# EAGLE design gocupi_0.7.0 (EAGLE 6.4)
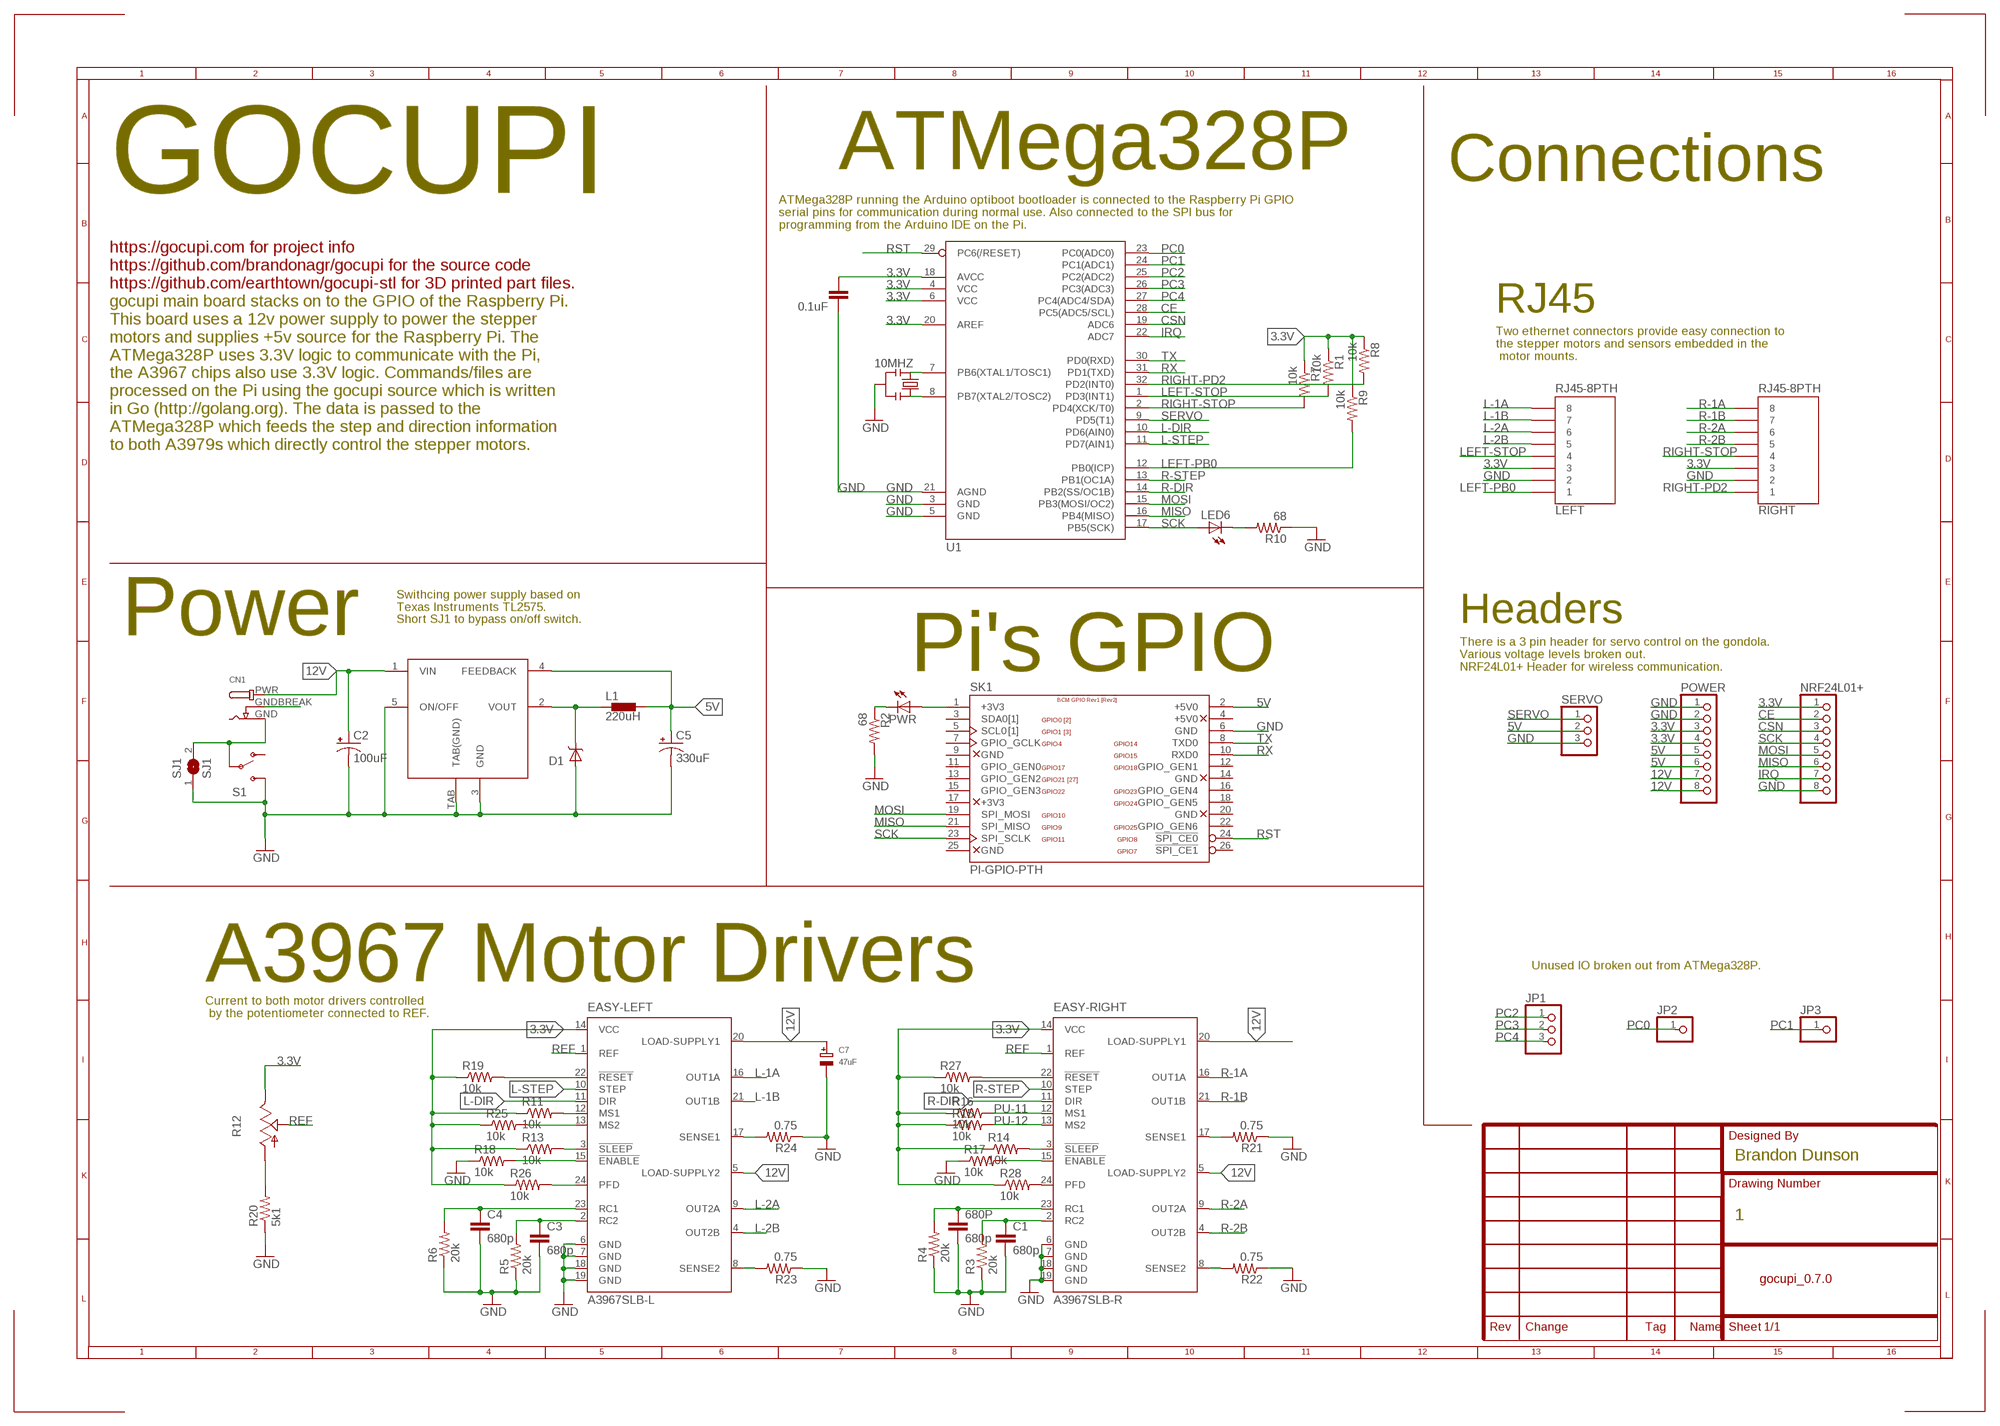
[diagram p0: schematic, sheet 1]

## Parts
10MHZ  RESONATORSMD  [RESONATOR-SMD]
680P  680p  CAP0805  [0805]
C1  680p  CAP0805  [0805]
C2  100uF  CPOL-USD  [PANASONIC_D]
C3  680p  CAP0805  [0805]
C4  680p  CAP0805  [0805]
C5  330uF  CPOL-USF  [PANASONIC_F]
C7  47uF  CAP_ELECTROLYTICPANASONIC_C  [PANASONIC_C]
C8  0.1uF  CAP0805  [0805]
CN1  DCBARRELSMT_CORRECT  [DCJACK_2MM_SMT]
D1  1N5819  DIODE-SCHOTTKY_  [SMA-DIODE]
EASY-LEFT  A3967SLB-L  A3967SLB  [SO24W]
EASY-RIGHT  A3967SLB-R  A3967SLB  [SO24W]
JP1  PINHD-1X3CB  [1X03-CLEANBIG]
JP2  PINHD-1X1CB  [1X01-CLEANBIG]
JP3  PINHD-1X1CB  [1X01-CLEANBIG]
L1  220uH  SDR1305  [SDR1305]
LED6  LEDCHIPLED_1206  [CHIPLED_1206]
LEFT  RJ45-8PTH  [RJ45-8]
NRF24L01+  PINHD-1X8BIG  [1X08-BIG]
POWER  PINHD-1X8CLEANBIG  [1X08-CLEANBIG]
PWR  LEDCHIPLED_1206  [CHIPLED_1206]
R1  10k  RESISTOR0805-RES  [0805]
R2  68  RESISTOR0805-RES  [0805]
R3  20k  RESISTOR0805-RES  [0805]
R4  20k  RESISTOR0805-RES  [0805]
R5  20k  RESISTOR0805-RES  [0805]
R6  20k  RESISTOR0805-RES  [0805]
R7  10k  RESISTOR0805-RES  [0805]
R8  10k  RESISTOR0805-RES  [0805]
R9  10k  RESISTOR0805-RES  [0805]
R10  68  RESISTOR0805-RES  [0805]
R11  10k  RESISTOR0805-RES  [0805]
R12  TRIM_US-SM-42/43A  [SM-42/43A]
R13  10k  RESISTOR0805-RES  [0805]
R14  10k  RESISTOR0805-RES  [0805]
R15  10k  RESISTOR0805-RES  [0805]
R16  10k  RESISTOR0805-RES  [0805]
R17  10k  RESISTOR0805-RES  [0805]
R18  10k  RESISTOR0805-RES  [0805]
R19  10k  RESISTOR0805-RES  [0805]
R20  5k1  RESISTOR0805-RES  [0805]
R21  0.75  RESISTOR0805-RES  [0805]
R22  0.75  RESISTOR0805-RES  [0805]
R23  0.75  RESISTOR0805-RES  [0805]
R24  0.75  RESISTOR0805-RES  [0805]
R25  10k  RESISTOR0805-RES  [0805]
R26  10k  RESISTOR0805-RES  [0805]
R27  10k  RESISTOR0805-RES  [0805]
R28  10k  RESISTOR0805-RES  [0805]
RIGHT  RJ45-8PTH  [RJ45-8]
S1  SWITCH-SPST-SMD-A  [SWITCH-SPST-SMD-A]
SERVO  PINHD-1X3  [1X03]
SJ1  SJ1  SJ  [SJ]
SK1  PI-GPIO-PTH  [GPIO-CONNECTOR]
U1  ATMEGA328_SMT  [TQFP32-08]
U$2  TL2575  [TO263_5]

## Nets
3.3V: C8.1 EASY-LEFT.14(VCC) EASY-RIGHT.14(VCC) LEFT.3 NRF24L01+.1 POWER.3 POWER.4 PWR.A R1.1 R7.1 R8.1 R9.1 R11.1 R12.3(E) R13.1 R14.1 R15.1 R16.1 R19.1 R25.1 R26.1 R27.1 R28.1 RIGHT.3 SK1.1(+3V3) U1.4(VCC) U1.6(VCC) U1.18(AVCC) U1.20(AREF)
5V: C5.+ L1.P$2 POWER.5 POWER.6 SERVO.2 SK1.2(+5V0) U$2.4(FEEDBACK)
12V: C2.+ C7.+ CN1.PWR EASY-LEFT.5(LOAD-SUPPLY2) EASY-LEFT.20(LOAD-SUPPLY1) EASY-RIGHT.5(LOAD-SUPPLY2) EASY-RIGHT.20(LOAD-SUPPLY1) POWER.7 POWER.8 U$2.1(VIN)
B-GND: CN1.GNDBREAK
CE: NRF24L01+.2 U1.28(PC5(ADC5/SCL))
CSN: NRF24L01+.3 U1.19(ADC6)
GND: 10MHZ.2 680P.2 C1.2 C2.- C3.2 C4.2 C5.- C7.- C8.2 D1.A EASY-LEFT.6(GND) EASY-LEFT.7(GND) EASY-LEFT.18(GND) EASY-LEFT.19(GND) EASY-RIGHT.6(GND) EASY-RIGHT.7(GND) EASY-RIGHT.18(GND) EASY-RIGHT.19(GND) LEFT.2 NRF24L01+.8 POWER.1 POWER.2 R2.2 R3.1 R4.1 R5.1 R6.1 R10.1 R17.1 R18.1 R20.1 R21.1 R22.1 R23.1 R24.1 RIGHT.2 S1.3(S) SERVO.3 SJ1.1 SK1.6(GND) U1.3(GND) U1.5(GND) U1.21(AGND) U$2.3(GND) U$2.5(ON/OFF) U$2.TAB(TAB(GND))
IRQ: NRF24L01+.7 U1.22(ADC7)
L-1A: EASY-LEFT.16(OUT1A) LEFT.8
L-1B: EASY-LEFT.21(OUT1B) LEFT.7
L-2A: EASY-LEFT.9(OUT2A) LEFT.6
L-2B: EASY-LEFT.4(OUT2B) LEFT.5
L-DIR: EASY-LEFT.11(DIR) U1.10(PD6(AIN0))
L-STEP: EASY-LEFT.10(STEP) U1.11(PD7(AIN1))
LEFT-PB0: LEFT.1 R9.2 U1.12(PB0(ICP))
LEFT-STOP: LEFT.4 R1.2 U1.1(PD3(INT1))
MISO: NRF24L01+.6 SK1.21(SPI_MISO) U1.16(PB4(MISO))
MOSI: NRF24L01+.5 SK1.19(SPI_MOSI) U1.15(PB3(MOSI/OC2))
N$1: D1.C L1.P$1 U$2.2(VOUT)
N$2: CN1.GND S1.2(P) SJ1.2
N$5: LED6.C R10.2
N$6: PWR.C R2.1
N$7: EASY-RIGHT.24(PFD) R28.2
N$8: EASY-LEFT.22(!RESET) R19.2
N$9: EASY-LEFT.12(MS1) R11.2
N$12: EASY-LEFT.24(PFD) R26.2
N$15: EASY-RIGHT.22(!RESET) R27.2
N$16: EASY-LEFT.13(MS2) R25.2
N$17: EASY-RIGHT.15(!ENABLE) R17.2
N$18: EASY-RIGHT.3(!SLEEP) R14.2
N$19: EASY-LEFT.3(!SLEEP) R13.2
N$21: R12.1(A) R20.2
N$26: EASY-LEFT.15(!ENABLE) R18.2
N$28: C4.1 EASY-LEFT.23(RC1) R6.2
N$29: C3.1 EASY-LEFT.2(RC2) R5.2
N$30: EASY-LEFT.17(SENSE1) R24.2
N$31: EASY-RIGHT.17(SENSE1) R21.2
N$32: EASY-LEFT.8(SENSE2) R23.2
N$33: 680P.1 EASY-RIGHT.23(RC1) R4.2
N$34: EASY-RIGHT.8(SENSE2) R22.2
N$35: C1.1 EASY-RIGHT.2(RC2) R3.2
N$39: 10MHZ.1 U1.7(PB6(XTAL1/TOSC1))
N$40: 10MHZ.3 U1.8(PB7(XTAL2/TOSC2))
PC0: JP2.1 U1.23(PC0(ADC0))
PC1: JP3.1 U1.24(PC1(ADC1))
PC2: JP1.1 U1.25(PC2(ADC2))
PC3: JP1.2 U1.26(PC3(ADC3))
PC4: JP1.3 U1.27(PC4(ADC4/SDA))
PU-11: EASY-RIGHT.12(MS1) R16.2
PU-12: EASY-RIGHT.13(MS2) R15.2
R-1A: EASY-RIGHT.16(OUT1A) RIGHT.8
R-1B: EASY-RIGHT.21(OUT1B) RIGHT.7
R-2A: EASY-RIGHT.9(OUT2A) RIGHT.6
R-2B: EASY-RIGHT.4(OUT2B) RIGHT.5
R-DIR: EASY-RIGHT.11(DIR) U1.14(PB2(SS/OC1B))
R-STEP: EASY-RIGHT.10(STEP) U1.13(PB1(OC1A))
REF: EASY-LEFT.1(REF) EASY-RIGHT.1(REF) R12.2(S)
RIGHT-PD2: R8.2 RIGHT.1 U1.32(PD2(INT0))
RIGHT-STOP: R7.2 RIGHT.4 U1.2(PD4(XCK/T0))
RST: SK1.24(!SPI_CE0) U1.29(PC6(/RESET))
RX: SK1.10(RXD0) U1.31(PD1(TXD))
SCK: LED6.A NRF24L01+.4 SK1.23(SPI_SCLK) U1.17(PB5(SCK))
SERVO: SERVO.1 U1.9(PD5(T1))
TX: SK1.8(TXD0) U1.30(PD0(RXD))
Unconnected: S1.1(O) SK1.3(SDA0) SK1.4(+5V0) SK1.5(SCL0) SK1.7(GPIO_GCLK) SK1.9(GND) SK1.11(GPIO_GEN0) SK1.12(GPIO_GEN1) SK1.13(GPIO_GEN2) SK1.14(GND) SK1.15(GPIO_GEN3) SK1.16(GPIO_GEN4) SK1.17(+3V3) SK1.18(GPIO_GEN5) SK1.20(GND) SK1.22(GPIO_GEN6) SK1.25(GND) SK1.26(!SPI_CE1)

## Notes on the sheet
- ATMega328P | Connections
- GOCUPI
- ATMega328P running the Arduino optiboot bootloader is connected to the Raspberry Pi GPIO 
  serial pins for communication during normal use. Also connected to the SPI bus for 
  programming from the Arduino IDE on the Pi.
- gocupi main board stacks on to the GPIO of the Raspberry Pi. 
  This board uses a 12v power supply to power the stepper 
  motors and supplies +5v source for the Raspberry Pi. The
  ATMega328P uses 3.3V logic to communicate with the Pi, 
  the A3967 chips also use 3.3V logic. Commands/files are 
  processed on the Pi using the gocupi source which is written 
  in Go (http://golang.org). The data is passed to the 
  ATMega328P which feeds the step and direction information
  to both A3979s which directly control the stepper motors.
- https://gocupi.com for project info
  https://github.com/brandonagr/gocupi for the source code
  https://github.com/earthtown/gocupi-stl for 3D printed part files.
- RJ45
- Two ethernet connectors provide easy connection to
  the stepper motors and sensors embedded in the
   motor mounts.
- Swithcing power supply based on 
  Texas Instruments TL2575.
- Short SJ1 to bypass on/off switch. | Headers
- Power
- Pi's GPIO
- There is a 3 pin header for servo control on the gondola.
  Various voltage levels broken out.
  NRF24L01+ Header for wireless communication.
- Unused IO broken out from ATMega328P.
- A3967 Motor Drivers
- Current to both motor drivers controlled
   by the potentiometer connected to REF.
- Brandon Dunson
- 1

## Library data of the parts
10MHZ = SwK-SparkFun:RESONATOR: Resonator Small SMD resonator. This is the itty bitty 10/20MHz resonators with built in caps. CSTCE10M0G55 and CSTCE20M0V53. Footprint has been reviewed closely but hasn't been tested yet.
680P C1 C3 C4 C8 = SparkFun-Passives:CAP: Capacitor Standard 0603 ceramic capacitor, and 0.1" leaded capacitor.
C2 C5 = adafruit:CPOL-US: POLARIZED CAPACITOR, American symbol
C7 = microbuilder:CAP_ELECTROLYTIC: Electrolytic Capacitors SMT PANASONIC_C - Size C Panasonic Electrolytic Aluminum Capacitor 47µF 16V 20% Electrolytic Capacitor [Digikey: PCE3890TR-ND] PANASONIC_D - Size D Panasonic Electrolytic Aluminum Capacitor 100µF 25V 20% Electrolytic Capacitor [Digikey: PCE3898TR-ND] PTH 3.5 mm grid, 8 mm diameter ... 3.5 mm grid, 10 mm diameter ...
CN1 = microbuilder:DCBARREL: DC Barrel Jack DCJACK_1.3MM_PTH - Through Hole 1.3mm Jack (4UConnector: 05536) DCJACK_2MM_PTH - Through Hole 2.0/2.1 Jack (4UConnector: 05537) DCJACK_2MM_SMT - SMT 2.0/2.1mm Jack(4UConnector: 03267)
D1 = SwK-SparkFun:DIODE-SCHOTTKY
EASY-LEFT EASY-RIGHT = allegro:A3967SLB: MICROSTEPPING DRIVER WITH TRANSLATOR Source: 3967.pdf; MF: ALLEGRO MICROSYSTEMS, INC.; MPN: A3967SLB-T; OC_FARNELL: 1521715; OC_NEWARK: 08J5877
JP1 SERVO = adafruit:PINHD-1X3: PIN HEADER
JP2 JP3 = adafruit:PINHD-1X1: Pin header 1x1 for 0.1" spacing With round pins
L1 = inductors:SDR1305
LED6 PWR = adafruit:LED: LED OSRAM: - CHIPLED LG R971, LG N971, LY N971, LG Q971, LY Q971, LO R971, LY R971 LH N974, LH R974 LS Q976, LO Q976, LY Q976 LO Q996 - Hyper CHIPLED LW Q18S LB Q993, LB Q99A, LB R99A - SideLED LS A670, LO A670, LY A670, LG A670, LP A670 LB A673, LV A673, LT A673, LW A673 LH A674 LY A675 LS A676, LA A676, LO A676, LY A676, LW A676 LS A679, LY A679, LG A679 - Hyper Micro SIDELED® LS Y876, LA Y876, LO Y876, LY Y876 LT Y87S - SmartLED LW L88C, LW L88S LB L89C, LB L89S, LG L890 LS L89K, LO L89K, LY L89K LS L896, LA L896, LO L896, LY L896 - TOPLED LS T670, LO T670, LY T670, LG T670, LP T670 LSG T670, LSP T670, LSY T670, LOP T670, LYG T670 LG T671, LOG T671, LSG T671 LB T673, LV T673, LT T673, LW T673 LH T674 LS T676, LA T676, LO T676, LY T676, LB T676, LH T676, LSB T676, LW T676 LB T67C, LV T67C, LT T67C, LS T67K, LO T67K, LY T67K, LW E67C LS E67B, LA E67B, LO E67B, LY E67B, LB E67C, LV E67C, LT E67C LW T67C LS T679, LY T679, LG T679 LS T770, LO T770, LY T770, LG T770, LP T770 LB T773, LV T773, LT T773, LW T773 LH T774 LS E675, LA E675, LY E675, LS T675 LS T776, LA T776, LO T776, LY T776, LB T776 LHGB T686 LT T68C, LB T68C - Hyper Mini TOPLED® LB M676 - Mini TOPLED Santana® LG M470 LS M47K, LO M47K, LY M47K Source: http://www.osram.convergy.de/
LEFT RIGHT = SparkFun-Connectors:RJ45-8: RJ45 Jack Simple RJ45, 8-pin connection - connector for common Cat5, Cat5e, and Cat6 Ethernet cables. Footprint not yet proven in production. Connector sku is PRT-00643; Breakout PCB sku is BOB-00716.
NRF24L01+ POWER = adafruit:PINHD-1X8: PIN HEADER
R1-R11 R13-R24 R26-R28 = SparkFun-Resistors:RESISTOR: Resistor Basic schematic elements and footprints for 0603, 1206, and PTH resistors.
R12 = pot:TRIM_US-: POTENTIOMETER
R25 = SparkFun-Passives:RESISTOR: Resistor Basic schematic elements and footprints for 0603, 1206, and PTH resistors.
S1 = SwK-SparkFun:SWITCH-SPST: SPST Switch Simple slide switch. Spark Fun Electronics SKU : COM-00102
SJ1 = jumper:SJ: SMD solder JUMPER
SK1 = jt-raspberry-pi:PI-: Raspberry Pi
U1 = SparkFun-DigitalIC:ATMEGA328_SMT: 32-Pin Atmega328 part Commonly used on Arduino compatible boards Available in QFP and QFN packages TQFP is IC-09069 QFN is non-stock; PROD_ID: IC-09069; VALUE: ATMEGA328P
U$2 = TL2575_new:TL2575

## Board
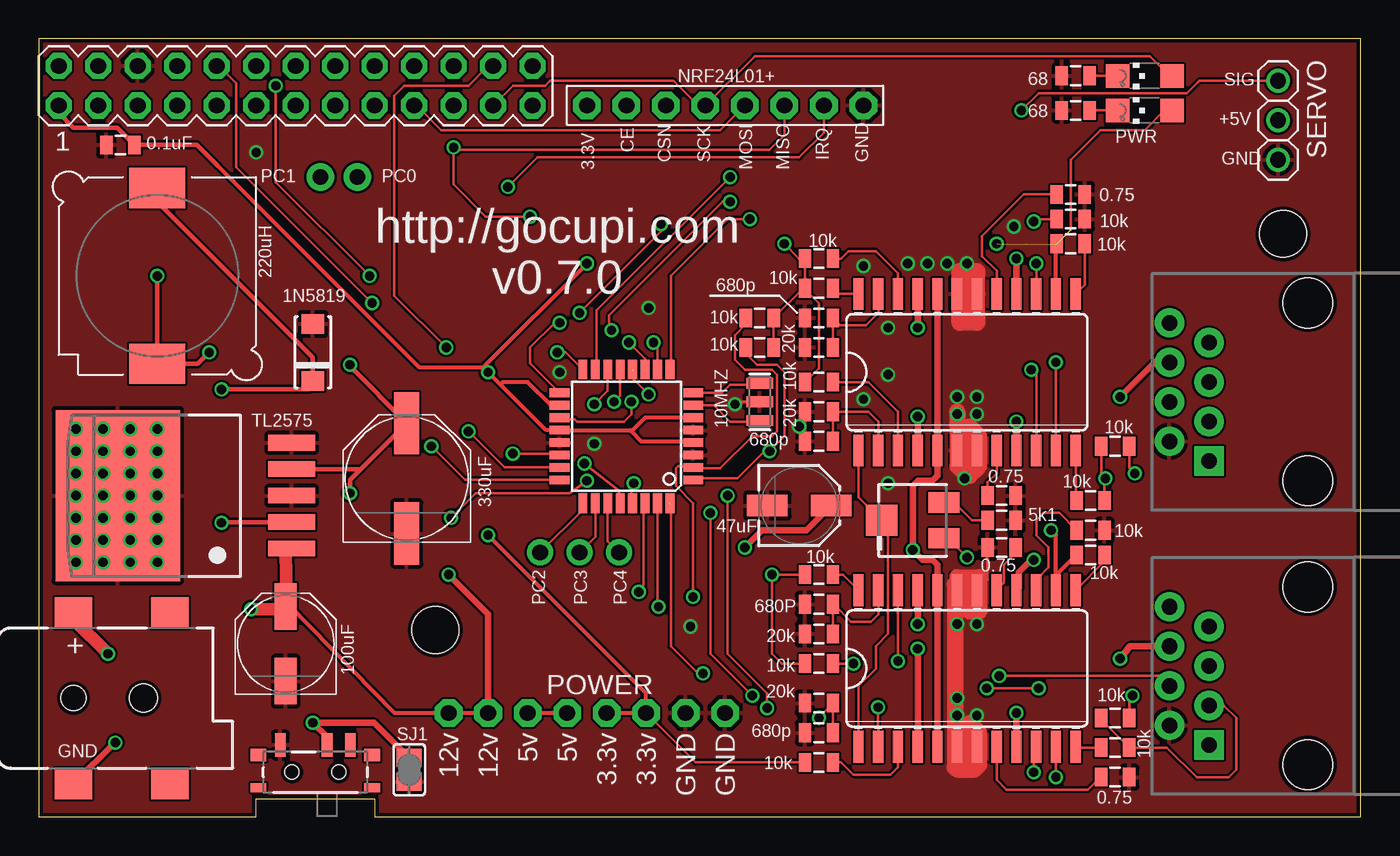
[diagram p1: board, top side]
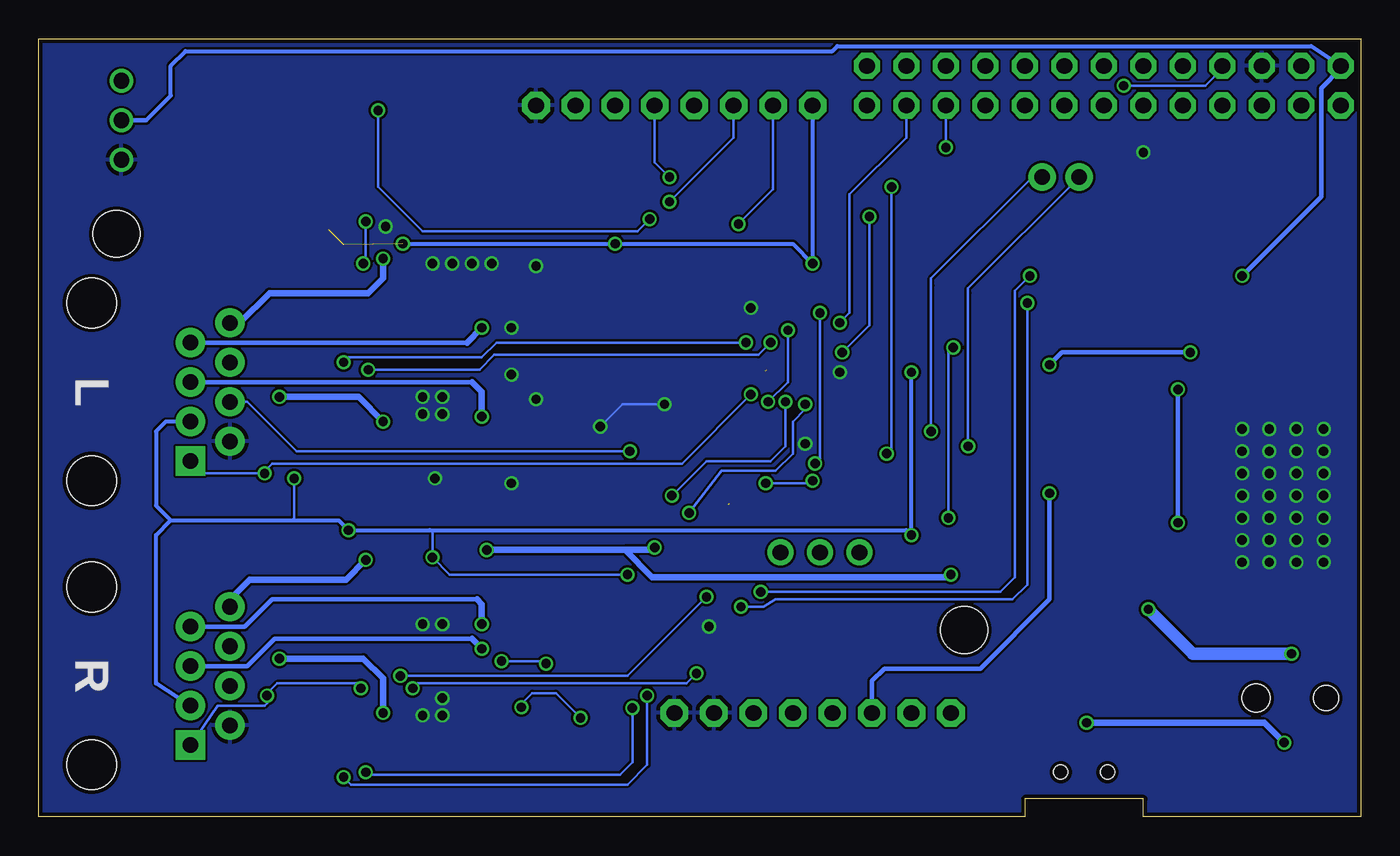
[diagram p2: board, bottom side, seen from below]

Size 85 x 50 mm. Coordinates in mm from the lower left corner, seen from the top.
Outline: 0,0 13.97,0 13.97,1.15 21.59,1.15 21.59,0 85,0 85,50 0,50 0,0
Copper layers (1*2*15*16): Top 0.035mm / dielectric 0.2mm / Route2 0.0175mm / dielectric 1.1mm / Route15 0.0175mm / dielectric 0.2mm / Bottom 0.035mm
Design rules "SeeedStudio_DRU_no_angle_20130527": minimum track width 6mil, minimum drill 12mil, track to track 6mil, track to pad 6mil, pad to pad 6mil, via to via 6mil, smd to smd 0mil, copper to edge 10mil, drill to drill 10mil, minimum pad ring 6mil, minimum via ring 6mil, stop-mask expansion 2mil, vias tented up to drill 25mil, thermal gap 10mil
Holes 3 mm at 80.01,37.47 25.5,12

### Footprints (pad centres in the part's own frame; a part is rotated, then mirrored left to right if it is on the bottom)
RESONATOR-SMD = smd 0.7 x 1.7: 1 -1.2,0; 2 0,0; 3 1.2,0
0805 = smd 0.8 x 1.2: 1 -0.9,0; 2 0.9,0
PANASONIC_D = smd 3 x 1.4: + 2.4,0; - -2.4,0
PANASONIC_F = smd 4 x 1.6: + 3.55,0; - -3.55,0
PANASONIC_C = smd 2.6 x 1.4: + 2.05,0; - -2.05,0
DCJACK_2MM_SMT = smd 2.4 x 2: GND 0,-5.5; GNDBREAK 6.2,-5.5; PWR 0,5.5; PWR2 6.2,5.5 | hole 1.6: 0,0 | hole 1.8: 4.5,0
SMA-DIODE = smd 1.27 x 1.47: A -1.833,0; C 1.833,0
SO24W = smd 0.66 x 2.032: 1 -6.985,-5.029; 2 -5.715,-5.029; 3 -4.445,-5.029; 4 -3.175,-5.029; 5 -1.905,-5.029; 6 -0.635,-5.029; 7 0.635,-5.029; 8 1.905,-5.029; 9 3.175,-5.029; 10 4.445,-5.029; 11 5.715,-5.029; 12 6.985,-5.029; 13 6.985,5.029; 14 5.715,5.029; 15 4.445,5.029; 16 3.175,5.029; 17 1.905,5.029; 18 0.635,5.029; 19 -0.635,5.029; 20 -1.905,5.029; 21 -3.175,5.029; 22 -4.445,5.029; 23 -5.715,5.029; 24 -6.985,5.029
1X03-CLEANBIG = drill 1.016 pad 1.676: 1 -2.54,0; 2 0,0; 3 2.54,0
1X01-CLEANBIG = drill 1.016 pad 1.778: 1 0,0
SDR1305 = smd 3.6 x 2.6: P$1 0,5.65; P$2 0,-5.65
CHIPLED_1206 = smd 1.5 x 1.5: A 0,-1.75; C 0,1.75
RJ45-8 = drill 1 pad 1.88 square: 1 -4.445,6.35 | drill 1 pad 1.88: 2 -3.175,8.89; 3 -1.905,6.35; 4 -0.635,8.89; 5 0.635,6.35; 6 1.905,8.89; 7 3.175,6.35; 8 4.445,8.89 | hole 3.2: -5.715,0; 5.715,0
1X08-BIG = drill 1.016 pad 1.778 octagon: 1 -8.89,0; 2 -6.35,0; 3 -3.81,0; 4 -1.27,0; 5 1.27,0; 6 3.81,0; 7 6.35,0; 8 8.89,0
1X08-CLEANBIG = drill 1.016 pad 1.778 octagon: 1 -8.89,0; 2 -6.35,0; 3 -3.81,0; 4 -1.27,0; 5 1.27,0; 6 3.81,0; 7 6.35,0; 8 8.89,0
SM-42/43A = smd 2 x 1.3: 1 2,1.15; 3 2,-1.15 | smd 2 x 2: 2 -2,0
SWITCH-SPST-SMD-A = smd 0.7 x 1.5: 1 -2.25,-1.75; 2 -0.75,-1.75; 3 2.25,-1.75 | smd 1 x 0.6: GND1 -3.65,1; GND3 3.65,1 | smd 1 x 0.8: GND2 -3.65,-1.1; GND4 3.65,-1.1 | hole 0.9: -1.5,0; 1.5,0
1X03 = drill 1.016: 1 -2.54,0; 2 0,0; 3 2.54,0
SJ = smd 1.168 x 1.6: 1 -0.762,0; 2 0.762,0
GPIO-CONNECTOR = drill 1.016 pad 1.676 octagon: 1 -15.24,-1.27; 2 -15.24,1.27; 3 -12.7,-1.27; 4 -12.7,1.27; 5 -10.16,-1.27; 6 -10.16,1.27; 7 -7.62,-1.27; 8 -7.62,1.27; 9 -5.08,-1.27; 10 -5.08,1.27; 11 -2.54,-1.27; 12 -2.54,1.27; 13 0,-1.27; 14 0,1.27; 15 2.54,-1.27; 16 2.54,1.27; 17 5.08,-1.27; 18 5.08,1.27; 19 7.62,-1.27; 20 7.62,1.27; 21 10.16,-1.27; 22 10.16,1.27; 23 12.7,-1.27; 24 12.7,1.27; 25 15.24,-1.27; 26 15.24,1.27
TQFP32-08 = smd 1.27 x 0.559: 1 -4.293,2.8; 2 -4.293,2; 3 -4.293,1.2; 4 -4.293,0.4; 5 -4.293,-0.4; 6 -4.293,-1.2; 7 -4.293,-2; 8 -4.293,-2.8; 17 4.293,-2.8; 18 4.293,-2; 19 4.293,-1.2; 20 4.293,-0.4; 21 4.293,0.4; 22 4.293,1.2; 23 4.293,2; 24 4.293,2.8 | smd 0.559 x 1.27: 9 -2.8,-4.293; 10 -2,-4.293; 11 -1.2,-4.293; 12 -0.4,-4.293; 13 0.4,-4.293; 14 1.2,-4.293; 15 2,-4.293; 16 2.8,-4.293; 25 2.8,4.293; 26 2,4.293; 27 1.2,4.293; 28 0.4,4.293; 29 -0.4,4.293; 30 -1.2,4.293; 31 -2,4.293; 32 -2.8,4.293
TO263_5 = smd 1 x 3: 1 -3.4,-8; 2 -1.7,-8; 3 0,-8; 4 1.7,-8; 5 3.4,-8 | smd 11 x 8: TAB 0,3.175

### Placement (x,y rotation side)
10MHZ  46.35,26.67 90 top
680P  50.16,13.65 180 top
C1  50.16,5.4 180 top
C2  15.88,11.11 90 top
C3  50.16,24.13 180 top
C4  50.16,32.07 180 top
C5  23.65,21.75 90 top
C7  48.9,20 0 top
C8  5.24,43.18 180 top
CN1  2.22,7.62 0 top
D1  17.62,29.84 270 top
EASY-LEFT  59.69,28.57 0 top
EASY-RIGHT  59.69,9.53 0 top
JP1  34.77,16.99 0 top
JP2  20.48,41.12 0 top
JP3  18.1,41.12 0 top
L1  7.62,34.77 0 top
LED6  71.12,47.62 90 top
LEFT  81.6,27.3 90 top
NRF24L01+  44.13,45.72 0 top
POWER  35.24,6.67 180 top
PWR  71.12,45.4 90 top
R1  46.35,30.16 180 top
R2  66.67,45.4 180 top
R3  50.16,7.3 0 top
R4  50.16,11.75 0 top
R5  50.16,26.04 0 top
R6  50.16,30.16 0 top
R7  46.35,32.07 180 top
R8  69.22,6.35 0 top
R9  69.22,23.81 0 top
R10  66.67,47.62 0 top
R11  67.63,20.32 180 top
R12  56.2,19.05 0 top
R13  50.16,27.94 0 top
R14  50.16,3.49 0 top
R15  67.63,16.83 0 top
R16  69.22,4.45 180 top
R17  67.63,18.41 180 top
R18  66.36,38.42 180 top
R19  50.16,35.88 0 top
R20  61.91,19.05 180 top
R21  61.91,17.3 0 top
R22  69.22,2.54 180 top
R23  61.91,20.64 180 top
R24  66.36,40.01 180 top
R25  66.36,36.83 0 top
R26  50.16,33.97 0 top
R27  50.16,9.84 0 top
R28  50.16,15.56 0 top
RIGHT  81.6,9.05 90 top
S1  17.78,2.86 180 top
SERVO  79.69,44.77 270 top
SJ1  23.81,3.02 90 top
SK1  16.51,46.99 0 top
U1  37.78,24.45 180 top
U$2  8.26,20.64 90 top

### Tracks (layer width: path | path; a pad name or v marks a point on that pad's centre or on a via)
3.3V  (via drill 0.6)  (3 unrouted)
  Top 0.152: PWR.A 72.39,45.4 71.12,44.13 68.26,44.13 66.36,42.23 66.36,37.73 | v47.94,36.83 48.9,35.88 R19.1 R26.1 49.27,33.92 | 49.27,33.92 50.16,33.02 50.16,28.84 R13.1 | R11.1 68.53,21.7 v68.58,21.75 | R12.3 58.46,17.9 v59.69,16.67 | R28.1 v47.15,15.56 47.15,10.48 47.78,9.84 R27.1 | R14.1 42.23,3.49 POWER.3 | RIGHT.3 76.2,7.14 76.99,6.35 76.99,3.02 76.52,2.54 74.45,2.54 72.55,4.45 R16.1 68.31,6.25 R8.1 | 49.27,33.92 49.11,33.92 R7.1 R1.1
  Top 0.154: R9.1 68.31,22.01 v68.58,21.75
  Top 0.254: POWER.4 POWER.3 39.05,7.94 v28.89,18.1 | 11.48,41.86 24.45,28.89 28.57,28.89 | 29.69,27.78 32.62,24.85 U1.20 38.02,24.85 38.1,24.77 | 29.69,27.78 v28.89,28.57 28.57,28.89 | U1.18 32.92,26.45 31.43,27.94 29.84,27.94 29.69,27.78 | 38.1,24.77 38.73,24.13 41.99,24.13 U1.4 | U1.6 38.98,25.65 38.1,24.77 | v35.24,35.56 28.57,28.89 | EASY-LEFT.14 65.41,36.78 | EASY-RIGHT.14 65.41,15.51 | 65.41,15.51 R15.1 | 65.41,15.51 65.41,18.1 v65.09,18.41
  Top 0.305: 11.48,41.86 10.16,43.18 C8.1 5.03,44.29 2.22,44.29 1.27,45.24 SK1.1
  Bottom 0.152: v68.58,21.75 68.58,19.21 68.74,19.05 | 59.85,18.41 59.69,18.26 v59.69,16.67 58.58,15.56 v47.15,15.56
  Bottom 0.254: NRF24L01+.1 v35.24,35.56 36.51,36.83 v47.94,36.83 v61.59,36.83 | v28.89,28.57 v28.89,18.1 29.21,18.41 59.85,18.41 v65.09,18.41 65.72,19.05 68.74,19.05 76.52,19.05 | LEFT.3 76.83,25.4 77.47,24.77 77.47,20 76.52,19.05 | RIGHT.3 77.47,8.57 77.47,18.1 76.52,19.05
5V  (via drill 0.6)
  Top 0.254: POWER.6 POWER.5
  Top 0.305: v7.62,34.77 L1.P$2 10.22,29.12 v10.95,29.84 | v20,29.05 20,28.95 C5.+ 20.77,22.41 20.69,22.34 | U$2.4 20.69,22.34 | v20,20.8 20,21.65 20.69,22.34
  Bottom 0.254: 78.11,44.77 76.52,46.35 76.52,48.26 75.56,49.21 33.97,49.21 33.66,49.53 3.17,49.53 SK1.2
  Bottom 0.305: SERVO.2 78.11,44.77 | SK1.2 1.27,48.1 2.54,46.83 2.54,39.85 v7.62,34.77 | v10.95,29.84 19.21,29.84 v20,29.05 | POWER.6 31.43,8.73 30.64,9.53 24.45,9.53 20,13.97 v20,20.8
12V  (via drill 0.6)
  Top 0.254: 15.94,13.57 16.1,13.59 22.86,6.67 POWER.8 POWER.7
  Top 0.406: v26.35,15.56 28.89,13.02 POWER.7 | EASY-LEFT.20 EASY-LEFT.5 57.78,21.91 57.47,21.59 56.52,21.59 56.2,21.27 v56.2,17.14 56.83,16.51 57.47,16.51 57.78,16.19 EASY-RIGHT.20 EASY-RIGHT.5 | C7.+ 49.37,18.41 46.51,18.41 v45.4,17.3
  Top 0.813: CN1.PWR 2.22,12.7 v4.45,10.48 | v13.65,13.34 15.7,13.34 C2.+ 15.94,13.57 15.88,17.14 15.97,17.24 U$2.1
  Bottom 0.406: v56.2,17.14 47.31,17.14 | 47.31,17.14 45.56,15.4 26.51,15.4 v26.35,15.56 | v45.4,17.3 45.56,17.14 47.31,17.14
  Bottom 0.813: v4.45,10.48 10.79,10.48 v13.65,13.34
CE  (via drill 0.6)
  Top 0.152: v40.01,38.1 40.01,37.62 v34.77,32.38 | U1.28 37.31,20.23 37.31,20.95 v35.08,22.7
  Bottom 0.152: NRF24L01+.2 37.78,40.32 v40.01,38.1 | v34.77,32.38 34.77,23.02 v35.08,22.7
CSN  (via drill 0.6)
  Top 0.152: v44.45,39.53 43.97,39.53 36.67,32.23 36.67,31.43 v36.83,31.27 | v38.1,26.67 38.1,25.88 37.62,25.4 34.61,25.4 34.45,25.56 33.58,25.56 U1.19
  Bottom 0.152: NRF24L01+.3 40.32,43.66 v44.45,39.53 | v36.83,31.27 36.83,27.94 v38.1,26.67
GND  (via drill 0.6)
  Top 0.152: 10MHZ.2 44.93,26.67 v44.77,26.51 | v48.9,25.08 49.21,25.08 49.21,25.98 R5.1 | R21.1 61.01,15.24 EASY-RIGHT.18
  Top 1.016: 59.21,33.81 59.21,35.08 60.33,35.08 60.33,31.75 59.21,31.75 59.21,34.29 59.53,34.61 59.53,32.54 59.85,32.23 | 59.05,26.04 59.05,22.54 59.69,21.91 59.85,21.91 60.48,22.54 60.48,24.45 59.85,25.08 59.85,22.7 | 59.05,15.4 60.48,15.4 60.48,13.18 59.85,13.18 59.69,13.34 59.69,14.76 59.05,14.76 58.9,14.92 58.9,3.17 59.05,3.02 60.17,3.02 60.48,3.33 60.48,5.4 59.85,6.03 59.85,3.65
  Bottom 0.152: v44.77,26.51 47.47,26.51 v48.9,25.08
  other vias: 2.38,24.92 4.13,24.92 5.87,24.92 7.62,24.92 2.38,23.5 4.13,23.5 5.87,23.5 7.62,23.5 2.38,22.07 4.13,22.07 5.87,22.07 7.62,22.07 2.38,20.64 4.13,20.64 5.87,20.64 7.62,20.64 2.38,19.21 4.13,19.21 5.87,19.21 7.62,19.21 2.38,17.78 4.13,17.78 5.87,17.78 7.62,17.78 2.38,16.35 4.13,16.35 5.87,16.35 7.62,16.35 59.05,7.62 60.33,6.51 59.05,6.51 59.05,26.99 60.33,26.99 60.33,25.88 59.05,25.88 54.61,31.43 54.61,28.42 54.61,21.43 59.05,12.38 60.33,12.38 59.69,35.56 58.42,35.56 57.15,35.56 55.88,35.56 59.53,21.75 39.21,32.7 41.91,12.22 33.5,28.57 13.97,42.7 62.71,37.94 53.02,35.4 53.02,26.83 35.72,23.97
  pour Top: -6.67,-3.65 87,-3.33 87,52.55 -6.67,52.55
  pour Bottom: -6.51,-4.45 87.63,-3.97 87.63,53.5 -6.51,53.5
IRQ  (via drill 0.6)
  Top 0.152: NRF24L01+.7 50.48,43.97 48.9,42.39 32.07,42.39 v30.16,40.48 | v30.48,23.34 33.4,23.34 U1.22
  Bottom 0.152: v30.16,40.48 30.16,23.65 v30.48,23.34
L-1A  (via drill 0.6)
  Top 0.406: v62.87,35.88 EASY-LEFT.16
  Bottom 0.406: LEFT.8 72.07,31.75 70.17,33.66 63.82,33.66 62.87,34.61 v62.87,35.88
L-1B  (via drill 0.6)
  Top 0.406: v56.52,31.43 EASY-LEFT.21
  Bottom 0.305: LEFT.7 57.47,30.48
  Bottom 0.406: 57.47,30.48 v56.52,31.43
L-2A  (via drill 0.6)
  Top 0.406: LEFT.6 71.75,29.21 v69.53,26.99 | v62.87,25.4 EASY-LEFT.9
  Bottom 0.406: v69.53,26.99 64.45,26.99 v62.87,25.4
L-2B  (via drill 0.6)
  Top 0.406: v56.52,25.72 EASY-LEFT.4
  Bottom 0.305: LEFT.5 57.15,27.94
  Bottom 0.406: 57.15,27.94 56.52,27.3 v56.52,25.72
L-DIR  (via drill 0.6)
  Top 0.152: U1.10 39.78,30.23 v39.53,30.48 | v65.41,29.21 EASY-LEFT.11
  Bottom 0.152: v39.53,30.48 55.56,30.48 56.52,29.53 65.09,29.53 v65.41,29.21
L-STEP  (via drill 0.6)
  Top 0.152: U1.11 38.98,29.44 v37.94,30.48 | v63.82,28.73 64.14,28.42 EASY-LEFT.10
  Bottom 0.152: v37.94,30.48 38.73,29.69 55.72,29.69 56.67,28.73 v63.82,28.73
LEFT-PB0  (via drill 0.6)  (1 unrouted)
  Top 0.152: 38.26,28.66 38.26,28.1 v39.21,27.15 | R9.2 70.11,22.44 v70.48,22.07
  Bottom 0.152: v39.21,27.15 43.66,22.7 70.01,22.7 70.48,22.23 v70.48,22.07 74.45,22.07 LEFT.1
LEFT-STOP  (via drill 0.6)
  Top 0.152: U1.1 42.18,21.75 44.93,21.75 46.67,23.5 v46.99,23.5 47.94,24.45 47.94,28.57 47.47,29.05 46.2,29.05 45.45,29.79 R1.2
  Bottom 0.152: LEFT.4 71.6,26.67 68.42,23.5 v46.99,23.5
MISO  (via drill 0.6)
  Top 0.152: NRF24L01+.6 47.94,43.81 46.99,42.86 26.67,42.86 v26.67,43.02 26.67,40.64 28.73,38.58 v31.59,38.58 | v33.34,29.84 33.88,29.84 U1.16
  Bottom 0.152: v31.59,38.58 31.59,31.59 v33.34,29.84 | v26.67,43.02 SK1.21
MOSI  (via drill 0.6)
  Top 0.152: v44.45,41.12 35.88,32.54 35.88,28.84 U1.15 | SK1.19 24.29,45.72 25.88,44.13 43.81,44.13 NRF24L01+.5
  Bottom 0.152: NRF24L01+.5 45.4,42.07 v44.45,41.12
N$1  (via drill 0.6)
  Top 0.305: L1.P$1 7.62,39.53 17.62,29.53 D1.C 17.39,27.46 v11.75,27.46 | U$2.2 11.79,18.94 v11.75,18.89
  Bottom 0.305: v11.75,18.89 v11.75,27.46
N$2  (via drill 0.6)
  Top 0.406: CN1.GND 4.87,4.76 v4.92,4.76 | S1.2 18.53,5.12 v17.62,6.03 21.56,6.03 SJ1.2
  Bottom 0.406: v4.92,4.76 6.19,6.03 v17.62,6.03
N$5
  Top 0.152: R10.2 LED6.C
N$6
  Top 0.152: R2.1 PWR.C
N$7
  Top 0.152: R28.2 51.7,15.56 EASY-RIGHT.24
N$8
  Top 0.152: EASY-LEFT.22 55.24,34.92 53.82,36.35 52.07,36.35 51.59,35.88 R19.2
N$9
  Top 0.152: EASY-LEFT.12 66.67,20.37 R11.2
N$12
  Top 0.152: EASY-LEFT.24 51.43,33.6 R26.2
N$15  (via drill 0.6)
  Top 0.154: EASY-RIGHT.22 v55.24,10 | v52.39,9.84 R27.2
  Bottom 0.154: v55.24,10 52.55,10 v52.39,9.84
N$16
  Top 0.152: R25.2 67.26,34.19 EASY-LEFT.13
N$17
  Top 0.152: R17.2 65.62,19.53 64.61,19.53 64.14,19.05 64.14,18.1 64.93,17.3 64.93,16.03 64.29,15.4 64.29,14.71 EASY-RIGHT.15
N$18
  Top 0.152: R14.2 51.59,3.49 52.39,2.7 54.77,2.7 55.24,3.17 EASY-RIGHT.3
N$19
  Top 0.152: R13.2 53.34,27.94 55.24,26.04 EASY-LEFT.3
N$21
  Top 0.152: R12.1 58.86,20.2 60.01,19.05 R20.2
N$26  (via drill 0.6)
  Top 0.152: R18.2 64.14,38.42 v63.98,38.26 | v64.14,35.56 EASY-LEFT.15
  Bottom 0.152: v63.98,38.26 63.98,35.72 v64.14,35.56
N$28
  Top 0.152: EASY-LEFT.23 53.98,32.38 53.18,31.59 51.54,31.59 C4.1 R6.2
N$29
  Top 0.152: EASY-LEFT.2 53.98,25.4 53.34,26.04 R5.2 C3.1
N$30
  Top 0.152: R24.2 63.34,40.01 60.64,37.31 60.64,36.04 61.59,35.08 EASY-LEFT.17
N$31
  Top 0.152: R21.2 62.81,16.93 62.07,16.19 62.07,15.03 EASY-RIGHT.17
N$32
  Top 0.152: R23.2 61.01,21.48 61.59,22.07 EASY-LEFT.8
N$33
  Top 0.152: EASY-RIGHT.23 53.98,13.02 53.5,12.54 52.23,12.54 51.12,13.65 680P.1 R4.2
N$34
  Top 0.152: R22.2 68.26,2.54 67.47,1.75 62.23,1.75 61.59,2.38 EASY-RIGHT.8
N$35  (via drill 0.6)
  Top 0.152: R3.2 C1.1
  Top 0.154: EASY-RIGHT.2 v53.97,7.03 | v50.16,6.35 50.16,6.4 R3.2
  Bottom 0.154: v53.97,7.03 53.97,7.26 53.28,7.95 51.75,7.94 v50.16,6.35
N$39
  Top 0.152: U1.7 43.4,26.45 44.45,25.4 46.28,25.4 10MHZ.1
N$40
  Top 0.152: U1.8 43.92,27.25 44.45,27.78 46.27,27.78 10MHZ.3
PC0  (via drill 0.6)
  Top 0.152: U1.23 29.94,22.45 v27.62,24.77
  Bottom 0.152: v27.62,24.77 27.62,34.13
  Bottom 0.154: 27.62,34.13 27.62,34.61 21.11,41.12 JP2.1
PC1  (via drill 0.6)
  Top 0.152: U1.24 27.41,21.65 v25.24,23.81
  Bottom 0.152: v25.24,23.81 25.24,33.66
  Bottom 0.154: 25.24,33.66 25.24,33.97 JP3.1
PC2
  Top 0.152: U1.25 34.98,19.74
  Top 0.154: 34.98,19.74 JP1.1
PC3
  Top 0.152: U1.26 35.78,18
  Top 0.154: 35.78,18 JP1.2
PC4
  Top 0.152: U1.27 36.58,17.71
  Top 0.154: 36.58,17.71 JP1.3
PU-11
  Top 0.152: R16.2 66.73,4.45 EASY-RIGHT.12
PU-12
  Top 0.152: R15.2 68.53,16.41 EASY-RIGHT.13
R-1A  (via drill 0.6)
  Top 0.406: v63.98,16.51 63.82,16.51 63.02,15.72 63.02,14.71 EASY-RIGHT.16
  Bottom 0.406: RIGHT.8 72.71,13.97 71.44,15.24 65.25,15.24 v63.98,16.51
R-1B  (via drill 0.6)
  Top 0.406: v56.52,12.38 EASY-RIGHT.21
  Bottom 0.305: RIGHT.7 71.75,12.22 70.01,13.97 56.83,13.97
  Bottom 0.406: 56.83,13.97 56.52,13.65 v56.52,12.38
R-2A  (via drill 0.6)
  Top 0.406: RIGHT.6 70.17,10.95 v69.53,10.16 | v62.87,6.67 EASY-RIGHT.9
  Bottom 0.406: v69.53,10.16 64.14,10.16 62.87,8.89 v62.87,6.67
R-2B  (via drill 0.6)
  Top 0.406: v56.52,10.79 EASY-RIGHT.4
  Bottom 0.305: RIGHT.5 71.6,9.68 69.85,11.43 57.15,11.43
  Bottom 0.406: 57.15,11.43 v56.52,10.79
R-DIR  (via drill 0.6)
  Top 0.152: U1.14 36.58,27.38 v35.72,26.51 | v43.18,19.53 43.18,10.48 v45.88,7.78 | v65.41,2.54 EASY-RIGHT.11
  Bottom 0.152: v43.18,19.53 41.12,22.23 37.62,22.23 36.51,23.34 36.51,25.4 35.72,26.19 v35.72,26.51 | v45.88,7.78 45.88,3.33 47.15,2.06 64.93,2.06 v65.41,2.54
R-STEP  (via drill 0.6)
  Top 0.152: U1.13 37.38,27.06 v36.99,26.67 | v44.29,20.64 44.29,10.48 46.83,7.94 v46.83,6.99 | v63.98,2.86 63.98,4.34 EASY-RIGHT.10
  Bottom 0.152: v36.99,26.67 36.99,23.81 37.94,22.86 42.07,22.86 v44.29,20.64 | v46.83,6.99 46.83,3.49 47.62,2.7 63.82,2.7 v63.98,2.86
REF
  Top 0.152: EASY-LEFT.1 52.7,20.54
  Top 0.154: EASY-RIGHT.1 52.7,8.41 53.82,9.53 53.82,10.95 54.61,11.75 54.61,18.64 R12.2 52.7,20.54
RIGHT-PD2  (via drill 0.6)  (1 unrouted)
  Top 0.152: 40.64,20.1 40.64,10.95 42.39,9.21 v42.7,9.21 | v60.96,8.26 v64.29,8.26 | R8.2 70.11,7.57 v70.33,7.78
  Bottom 0.152: v42.7,9.21 43.34,8.57 60.64,8.57 v60.96,8.26 | v64.29,8.26 64.61,8.57 69.69,8.57 70.33,7.94 v70.33,7.78 70.33,7.3 70.48,7.14 73.5,7.14 RIGHT.1
RIGHT-STOP  (via drill 0.6)
  Top 0.152: RIGHT.4 72.07,9.05 v61.75,9.05 | v42.07,14.13 42.07,20.16 40.96,21.27 40.96,22.38 41.12,22.54 41.98,22.54 U1.2 42.14,22.38 43.81,22.38 45.88,24.45 47.15,24.45 47.47,24.77 47.47,28.42 47.15,28.73 45.4,28.73 44.77,29.37 44.77,30.96 45.45,31.64 R7.2
  Bottom 0.152: v61.75,9.05 47.15,9.05 v42.07,14.13
RST  (via drill 0.6)
  Top 0.152: SK1.24 28.89,48.26 27.62,46.99 23.5,46.99 22.86,46.35 22.86,33.5 v26.19,30.16 | U1.29 38.1,20.07 38.1,21.27 v38.26,21.43 | v35.24,21.59 34.13,20.8 28.1,20.8 v26.51,19.21
  Bottom 0.152: v26.19,30.16 26.51,29.84 v26.51,19.21 | v38.26,21.43 35.24,21.43 v35.24,21.59
RX  (via drill 0.6)
  Top 0.152: U1.31 39.78,13.75 v39.85,13.49 | v21.43,33.02 12.7,41.75 12.7,47.15 11.59,48.26 SK1.10
  Bottom 0.152: v39.85,13.49 38.42,13.49 37.62,13.97 22.38,13.97 21.43,14.92 v21.43,33.02
SCK  (via drill 0.6)
  Top 0.152: LED6.A 72.71,47.62 71.44,48.9 46.04,48.9 NRF24L01+.4 42.39,45.72 40.8,47.31 32.86,47.31 32.54,46.99 30.48,46.99 SK1.23 | v33.5,31.75 33.18,31.75 31.59,30.16 31.59,29.15 U1.17
  Bottom 0.152: SK1.23 29.21,43.66 32.86,40.01 32.86,32.38 v33.5,31.75
SERVO  (via drill 0.6)
  Top 0.152: v63.18,45.4 64.29,46.51 73.82,46.51 74.53,47.23 74.61,47.31 SERVO.1 | v45.72,38.42 44.29,38.42 40.64,34.77 40.64,28.8 U1.9
  Bottom 0.152: v63.18,45.4 63.18,40.48 60.33,37.62 46.51,37.62 v45.72,38.42
TX  (via drill 0.6)
  Top 0.152: U1.30 38.89,20.07 38.89,14.92 v38.58,14.45 | v21.27,34.77 15.24,40.8 v15.24,46.99
  Bottom 0.152: v38.58,14.45 23.18,14.45 22.23,15.4 22.23,33.81 v21.27,34.77 | v15.24,46.99 10,46.99 8.89,48.1 SK1.8

### Text on the board
tPlace: SIG | +5V | CE | PC1 | PC0 | 3.3V | CSN | SCK | MOSI | MISO | IRQ | GND | GND | http://gocupi.com / v0.7.0 | PC2 | PC3 | PC4
bPlace: L | R